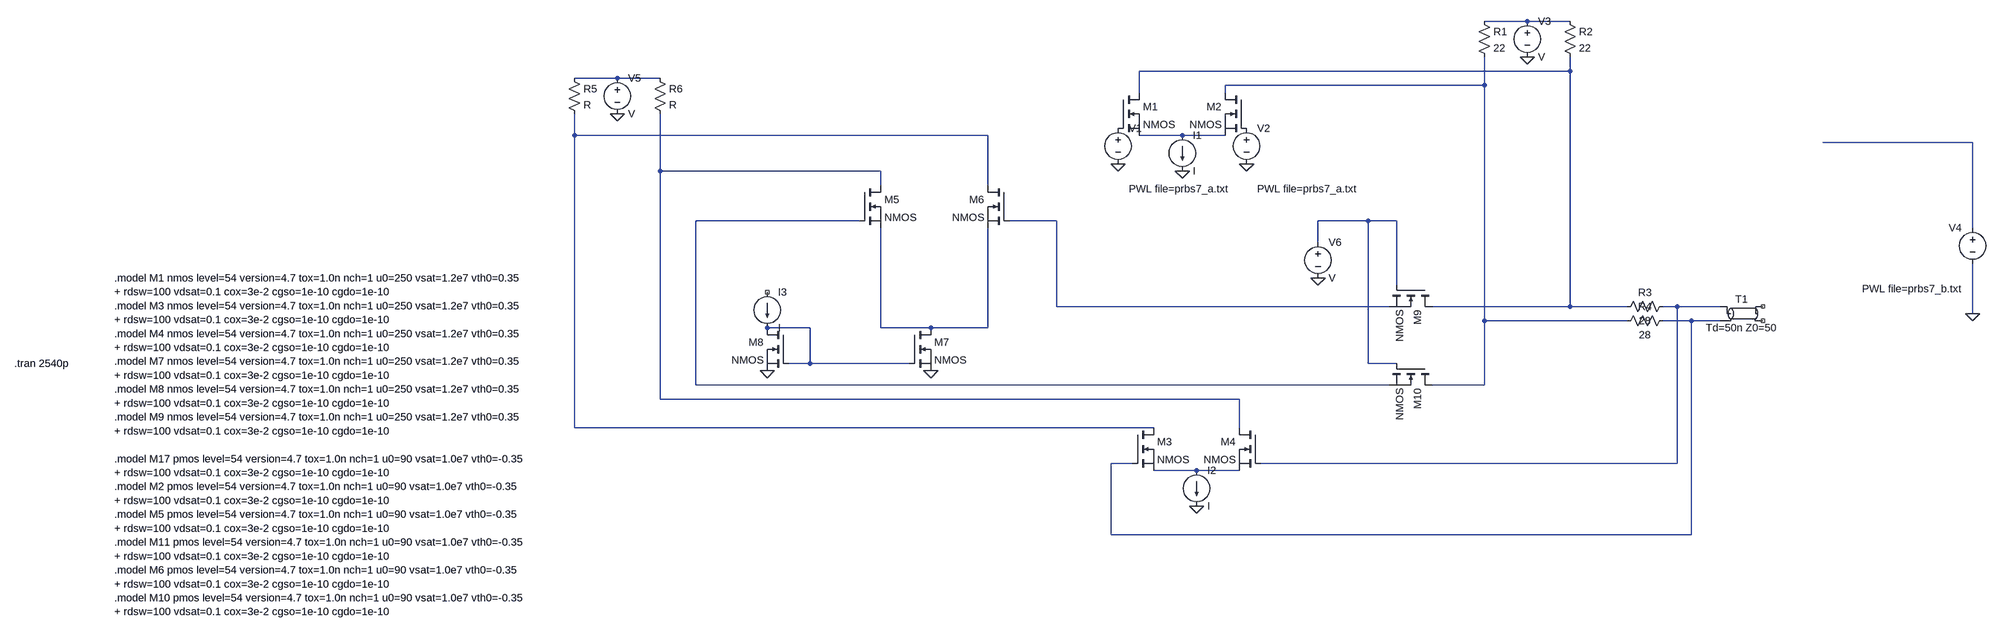
[diagram p0: schematic rgm.asc]
rgm.asc, the LTspice schematic file:
Version 4
SHEET 1 6692 816
WIRE 3520 -1328 3424 -1328
WIRE 3616 -1328 3520 -1328
WIRE 3616 -1216 3616 -1248
WIRE 3616 -1216 2608 -1216
WIRE 1280 -1200 1184 -1200
WIRE 1376 -1200 1280 -1200
WIRE 3424 -1184 3424 -1248
WIRE 3424 -1184 2800 -1184
WIRE 2608 -1168 2608 -1216
WIRE 2800 -1168 2800 -1184
WIRE 1184 -1072 1184 -1120
WIRE 2112 -1072 1184 -1072
WIRE 2704 -1072 2608 -1072
WIRE 2800 -1072 2704 -1072
WIRE 6656 -1056 6320 -1056
WIRE 1376 -992 1376 -1120
WIRE 1872 -992 1376 -992
WIRE 1872 -960 1872 -992
WIRE 2112 -960 2112 -1072
WIRE 1824 -880 1456 -880
WIRE 2288 -880 2160 -880
WIRE 3120 -880 3008 -880
WIRE 3184 -880 3120 -880
WIRE 6656 -864 6656 -1056
WIRE 3008 -832 3008 -880
WIRE 3184 -736 3184 -880
WIRE 2288 -688 2288 -880
WIRE 3168 -688 2288 -688
WIRE 3616 -688 3616 -1216
WIRE 3616 -688 3264 -688
WIRE 3744 -688 3616 -688
WIRE 3856 -688 3824 -688
WIRE 3952 -688 3856 -688
WIRE 6656 -672 6656 -784
WIRE 3424 -656 3424 -1184
WIRE 3744 -656 3424 -656
WIRE 3888 -656 3824 -656
WIRE 3952 -656 3888 -656
WIRE 1712 -640 1616 -640
WIRE 1872 -640 1872 -864
WIRE 1984 -640 1872 -640
WIRE 2112 -640 2112 -864
WIRE 2112 -640 1984 -640
WIRE 1712 -560 1712 -640
WIRE 1712 -560 1664 -560
WIRE 1936 -560 1712 -560
WIRE 3120 -560 3120 -880
WIRE 3184 -560 3120 -560
WIRE 1456 -512 1456 -880
WIRE 3168 -512 1456 -512
WIRE 3424 -512 3424 -656
WIRE 3424 -512 3264 -512
WIRE 1376 -480 1376 -992
WIRE 2832 -480 1376 -480
WIRE 1184 -416 1184 -1072
WIRE 2640 -416 1184 -416
WIRE 2832 -416 2832 -480
WIRE 2592 -336 2544 -336
WIRE 3856 -336 3856 -688
WIRE 3856 -336 2880 -336
WIRE 2736 -320 2640 -320
WIRE 2832 -320 2736 -320
WIRE 2544 -176 2544 -336
WIRE 3888 -176 3888 -656
WIRE 3888 -176 2544 -176
FLAG 2560 -1008 0
FLAG 6656 -672 0
FLAG 2704 -992 0
FLAG 2848 -1008 0
FLAG 3520 -1248 0
FLAG 2736 -240 0
FLAG 1280 -1120 0
FLAG 1616 -544 0
FLAG 1984 -544 0
FLAG 3008 -752 0
SYMBOL voltage 2560 -1104 R0
WINDOW 3 24 152 Left 2
WINDOW 123 0 0 Left 0
WINDOW 39 24 124 Left 2
SYMATTR Value PWL file=prbs7_a.txt
SYMATTR InstName V1
SYMBOL voltage 6656 -880 M0
WINDOW 3 24 152 Left 2
WINDOW 123 0 0 Left 0
WINDOW 39 24 124 Left 2
SYMATTR Value PWL file=prbs7_b.txt
SYMATTR InstName V4
SYMBOL nmos 2560 -1168 R0
SYMATTR InstName M1
SYMBOL current 2704 -1072 R0
SYMATTR InstName I1
SYMBOL voltage 2848 -1104 R0
WINDOW 3 24 152 Left 2
WINDOW 123 0 0 Left 0
WINDOW 39 24 124 Left 2
SYMATTR Value PWL file=prbs7_a.txt
SYMATTR InstName V2
SYMBOL res 3408 -1344 R0
SYMATTR InstName R1
SYMATTR Value 22
SYMBOL res 3600 -1344 R0
SYMATTR InstName R2
SYMATTR Value 22
SYMBOL voltage 3520 -1344 R0
SYMATTR InstName V3
SYMBOL tline 4000 -672 R0
SYMATTR InstName T1
SYMBOL res 3840 -704 R90
WINDOW 0 0 56 VBottom 2
WINDOW 3 32 56 VTop 2
SYMATTR InstName R3
SYMATTR Value 28
SYMBOL res 3840 -672 R90
WINDOW 0 0 56 VBottom 2
WINDOW 3 32 56 VTop 2
SYMATTR InstName R4
SYMATTR Value 28
SYMBOL nmos 2592 -416 R0
SYMATTR InstName M3
SYMBOL current 2736 -320 R0
SYMATTR InstName I2
SYMBOL nmos 1824 -960 R0
SYMATTR InstName M5
SYMBOL res 1168 -1216 R0
SYMATTR InstName R5
SYMBOL res 1360 -1216 R0
SYMATTR InstName R6
SYMBOL voltage 1280 -1216 R0
SYMATTR InstName V5
SYMBOL nmos 2848 -1168 M0
SYMATTR InstName M2
SYMBOL nmos 2880 -416 M0
SYMATTR InstName M4
SYMBOL nmos 2160 -960 M0
SYMATTR InstName M6
SYMBOL nmos 1936 -640 R0
SYMATTR InstName M7
SYMBOL nmos 1664 -640 M0
SYMATTR InstName M8
SYMBOL nmos 3264 -736 R90
SYMATTR InstName M9
SYMBOL nmos 3264 -560 R90
SYMATTR InstName M10
SYMBOL current 1616 -720 R0
SYMATTR InstName I3
SYMBOL voltage 3008 -848 R0
SYMATTR InstName V6
TEXT -624 -560 Left 2 !.tran 2540p
TEXT -80 -752 Left 2 !.model M1 nmos level=54 version=4.7 tox=1.0n nch=1 u0=250 vsat=1.2e7 vth0=0.35\n+ rdsw=100 vdsat=0.1 cox=3e-2 cgso=1e-10 cgdo=1e-10\n.model M3 nmos level=54 version=4.7 tox=1.0n nch=1 u0=250 vsat=1.2e7 vth0=0.35\n+ rdsw=100 vdsat=0.1 cox=3e-2 cgso=1e-10 cgdo=1e-10\n.model M4 nmos level=54 version=4.7 tox=1.0n nch=1 u0=250 vsat=1.2e7 vth0=0.35\n+ rdsw=100 vdsat=0.1 cox=3e-2 cgso=1e-10 cgdo=1e-10\n.model M7 nmos level=54 version=4.7 tox=1.0n nch=1 u0=250 vsat=1.2e7 vth0=0.35\n+ rdsw=100 vdsat=0.1 cox=3e-2 cgso=1e-10 cgdo=1e-10\n.model M8 nmos level=54 version=4.7 tox=1.0n nch=1 u0=250 vsat=1.2e7 vth0=0.35\n+ rdsw=100 vdsat=0.1 cox=3e-2 cgso=1e-10 cgdo=1e-10\n.model M9 nmos level=54 version=4.7 tox=1.0n nch=1 u0=250 vsat=1.2e7 vth0=0.35\n+ rdsw=100 vdsat=0.1 cox=3e-2 cgso=1e-10 cgdo=1e-10\n \n.model M17 pmos level=54 version=4.7 tox=1.0n nch=1 u0=90 vsat=1.0e7 vth0=-0.35\n+ rdsw=100 vdsat=0.1 cox=3e-2 cgso=1e-10 cgdo=1e-10\n.model M2 pmos level=54 version=4.7 tox=1.0n nch=1 u0=90 vsat=1.0e7 vth0=-0.35\n+ rdsw=100 vdsat=0.1 cox=3e-2 cgso=1e-10 cgdo=1e-10\n.model M5 pmos level=54 version=4.7 tox=1.0n nch=1 u0=90 vsat=1.0e7 vth0=-0.35\n+ rdsw=100 vdsat=0.1 cox=3e-2 cgso=1e-10 cgdo=1e-10\n.model M11 pmos level=54 version=4.7 tox=1.0n nch=1 u0=90 vsat=1.0e7 vth0=-0.35\n+ rdsw=100 vdsat=0.1 cox=3e-2 cgso=1e-10 cgdo=1e-10\n.model M6 pmos level=54 version=4.7 tox=1.0n nch=1 u0=90 vsat=1.0e7 vth0=-0.35\n+ rdsw=100 vdsat=0.1 cox=3e-2 cgso=1e-10 cgdo=1e-10\n.model M10 pmos level=54 version=4.7 tox=1.0n nch=1 u0=90 vsat=1.0e7 vth0=-0.35\n+ rdsw=100 vdsat=0.1 cox=3e-2 cgso=1e-10 cgdo=1e-10

The netlist it stands for:
* rgm.asc
V1 P001 0 PWL file=prbs7_a.txt
V4 N007 0 PWL file=prbs7_b.txt
M1 N002 P001 N006 N006 NMOS
I1 N006 0 I
V2 P002 0 PWL file=prbs7_a.txt
R1 N001 N004 22
R2 N001 N002 22
V3 N001 0 V
T1 N012 N013 NC_01 NC_02 Td=50n Z0=50
R3 N012 N002 28
R4 N013 N004 28
M3 N005 N013 N016 N016 NMOS
I2 N016 0 I
M5 N008 N009 N015 N015 NMOS
R5 N003 N005 R
R6 N003 N008 R
V5 N003 0 V
M2 N004 P002 N006 N006 NMOS
M4 N008 N012 N016 N016 NMOS
M6 N005 N010 N015 N015 NMOS
M7 N015 N014 0 0 NMOS
M8 N014 N014 0 0 NMOS
M9 N002 N011 N010 N010 NMOS
M10 N004 N011 N009 N009 NMOS
I3 NC_03 N014 I
V6 N011 0 V
.model NMOS NMOS
.model PMOS PMOS
.lib standard.mos
.tran 2540p
.model M1 nmos level=54 version=4.7 tox=1.0n nch=1 u0=250 vsat=1.2e7 vth0=0.35
+ rdsw=100 vdsat=0.1 cox=3e-2 cgso=1e-10 cgdo=1e-10
.model M3 nmos level=54 version=4.7 tox=1.0n nch=1 u0=250 vsat=1.2e7 vth0=0.35
+ rdsw=100 vdsat=0.1 cox=3e-2 cgso=1e-10 cgdo=1e-10
.model M4 nmos level=54 version=4.7 tox=1.0n nch=1 u0=250 vsat=1.2e7 vth0=0.35
+ rdsw=100 vdsat=0.1 cox=3e-2 cgso=1e-10 cgdo=1e-10
.model M7 nmos level=54 version=4.7 tox=1.0n nch=1 u0=250 vsat=1.2e7 vth0=0.35
+ rdsw=100 vdsat=0.1 cox=3e-2 cgso=1e-10 cgdo=1e-10
.model M8 nmos level=54 version=4.7 tox=1.0n nch=1 u0=250 vsat=1.2e7 vth0=0.35
+ rdsw=100 vdsat=0.1 cox=3e-2 cgso=1e-10 cgdo=1e-10
.model M9 nmos level=54 version=4.7 tox=1.0n nch=1 u0=250 vsat=1.2e7 vth0=0.35
+ rdsw=100 vdsat=0.1 cox=3e-2 cgso=1e-10 cgdo=1e-10
.model M17 pmos level=54 version=4.7 tox=1.0n nch=1 u0=90 vsat=1.0e7 vth0=-0.35
+ rdsw=100 vdsat=0.1 cox=3e-2 cgso=1e-10 cgdo=1e-10
.model M2 pmos level=54 version=4.7 tox=1.0n nch=1 u0=90 vsat=1.0e7 vth0=-0.35
+ rdsw=100 vdsat=0.1 cox=3e-2 cgso=1e-10 cgdo=1e-10
.model M5 pmos level=54 version=4.7 tox=1.0n nch=1 u0=90 vsat=1.0e7 vth0=-0.35
+ rdsw=100 vdsat=0.1 cox=3e-2 cgso=1e-10 cgdo=1e-10
.model M11 pmos level=54 version=4.7 tox=1.0n nch=1 u0=90 vsat=1.0e7 vth0=-0.35
+ rdsw=100 vdsat=0.1 cox=3e-2 cgso=1e-10 cgdo=1e-10
.model M6 pmos level=54 version=4.7 tox=1.0n nch=1 u0=90 vsat=1.0e7 vth0=-0.35
+ rdsw=100 vdsat=0.1 cox=3e-2 cgso=1e-10 cgdo=1e-10
.model M10 pmos level=54 version=4.7 tox=1.0n nch=1 u0=90 vsat=1.0e7 vth0=-0.35
+ rdsw=100 vdsat=0.1 cox=3e-2 cgso=1e-10 cgdo=1e-10
.backanno
.end